# Altium schematic sheet Ultrascale_EG2.SchDoc
size B; Organization: Altium Limited; Address1: L3, 12a Rodborough Rd; Address2: Frenchs Forest; Address3: NSW; Address4: Australia 2086
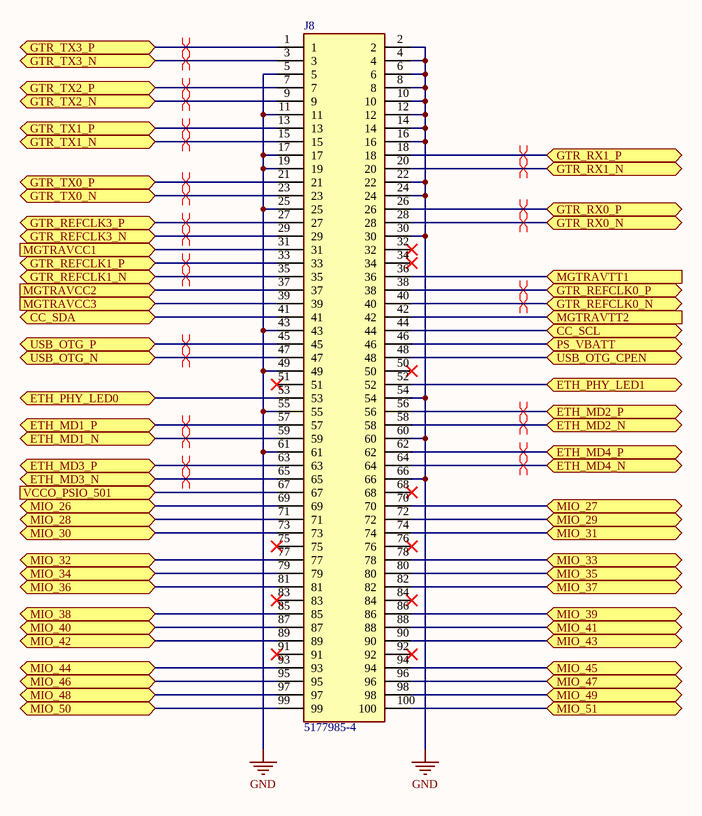
[diagram p0: Ultrascale_EG2.SchDoc]

## Parts
J8  5177985-4  [5177985-4]

## Ports
CC_SCL (bidir), CC_SDA (bidir), ETH_MD1_N (bidir), ETH_MD1_P (bidir), ETH_MD2_N (bidir), ETH_MD2_P (bidir), ETH_MD3_N (bidir), ETH_MD3_P (bidir), ETH_MD4_N (bidir), ETH_MD4_P (bidir), ETH_PHY_LED0 (bidir), ETH_PHY_LED1 (bidir), GTR_REFCLK0_N (bidir), GTR_REFCLK0_P (bidir), GTR_REFCLK1_N (bidir), GTR_REFCLK1_P (bidir), GTR_REFCLK3_N (bidir), GTR_REFCLK3_P (bidir), GTR_RX0_N (bidir), GTR_RX0_P (bidir), GTR_RX1_N (bidir), GTR_RX1_P (bidir), GTR_TX0_N (bidir), GTR_TX0_P (bidir), GTR_TX1_N (bidir), GTR_TX1_P (bidir), GTR_TX2_N (bidir), GTR_TX2_P (bidir), GTR_TX3_N (bidir), GTR_TX3_P (bidir), MGTRAVCC1 (in), MGTRAVCC2 (in), MGTRAVCC3 (in), MGTRAVTT1 (in), MGTRAVTT2 (in), MIO_26 (bidir), MIO_27 (bidir), MIO_28 (bidir), MIO_29 (bidir), MIO_30 (bidir), MIO_31 (bidir), MIO_32 (bidir), MIO_33 (bidir), MIO_34 (bidir), MIO_35 (bidir), MIO_36 (bidir), MIO_37 (bidir), MIO_38 (bidir), MIO_39 (bidir), MIO_40 (bidir), MIO_41 (bidir), MIO_42 (bidir), MIO_43 (bidir), MIO_44 (bidir), MIO_45 (bidir), MIO_46 (bidir), MIO_47 (bidir), MIO_48 (bidir), MIO_49 (bidir), MIO_50 (bidir), MIO_51 (bidir), PS_VBATT (bidir), USB_OTG_CPEN (bidir), USB_OTG_N (bidir), USB_OTG_P (bidir), VCCO_PSIO_501 (in)

## Nets
GND: J8.2 J8.4 J8.5 J8.6 J8.8 J8.10 J8.11 J8.12 J8.14 J8.16 J8.17 J8.19 J8.22 J8.24 J8.25 J8.30 J8.43 J8.49 J8.54 J8.55 J8.60 J8.61 J8.66
CC_SCL: J8.44 ; port CC_SCL
CC_SDA: J8.41 ; port CC_SDA
ETH_MD1_N: J8.59 ; port ETH_MD1_N
ETH_MD1_P: J8.57 ; port ETH_MD1_P
ETH_MD2_N: J8.58 ; port ETH_MD2_N
ETH_MD2_P: J8.56 ; port ETH_MD2_P
ETH_MD3_N: J8.65 ; port ETH_MD3_N
ETH_MD3_P: J8.63 ; port ETH_MD3_P
ETH_MD4_N: J8.64 ; port ETH_MD4_N
ETH_MD4_P: J8.62 ; port ETH_MD4_P
ETH_PHY_LED0: J8.53 ; port ETH_PHY_LED0
ETH_PHY_LED1: J8.52 ; port ETH_PHY_LED1
GTR_REFCLK0_N: J8.40 ; port GTR_REFCLK0_N
GTR_REFCLK0_P: J8.38 ; port GTR_REFCLK0_P
GTR_REFCLK1_N: J8.35 ; port GTR_REFCLK1_N
GTR_REFCLK1_P: J8.33 ; port GTR_REFCLK1_P
GTR_REFCLK3_N: J8.29 ; port GTR_REFCLK3_N
GTR_REFCLK3_P: J8.27 ; port GTR_REFCLK3_P
GTR_RX0_N: J8.28 ; port GTR_RX0_N
GTR_RX0_P: J8.26 ; port GTR_RX0_P
GTR_RX1_N: J8.20 ; port GTR_RX1_N
GTR_RX1_P: J8.18 ; port GTR_RX1_P
GTR_TX0_N: J8.23 ; port GTR_TX0_N
GTR_TX0_P: J8.21 ; port GTR_TX0_P
GTR_TX1_N: J8.15 ; port GTR_TX1_N
GTR_TX1_P: J8.13 ; port GTR_TX1_P
GTR_TX2_N: J8.9 ; port GTR_TX2_N
GTR_TX2_P: J8.7 ; port GTR_TX2_P
GTR_TX3_N: J8.3 ; port GTR_TX3_N
GTR_TX3_P: J8.1 ; port GTR_TX3_P
MGTRAVCC1: J8.31 ; port MGTRAVCC1
MGTRAVCC2: J8.37 ; port MGTRAVCC2
MGTRAVCC3: J8.39 ; port MGTRAVCC3
MGTRAVTT1: J8.36 ; port MGTRAVTT1
MGTRAVTT2: J8.42 ; port MGTRAVTT2
MIO_26: J8.69 ; port MIO_26
MIO_27: J8.70 ; port MIO_27
MIO_28: J8.71 ; port MIO_28
MIO_29: J8.72 ; port MIO_29
MIO_30: J8.73 ; port MIO_30
MIO_31: J8.74 ; port MIO_31
MIO_32: J8.77 ; port MIO_32
MIO_33: J8.78 ; port MIO_33
MIO_34: J8.79 ; port MIO_34
MIO_35: J8.80 ; port MIO_35
MIO_36: J8.81 ; port MIO_36
MIO_37: J8.82 ; port MIO_37
MIO_38: J8.85 ; port MIO_38
MIO_39: J8.86 ; port MIO_39
MIO_40: J8.87 ; port MIO_40
MIO_41: J8.88 ; port MIO_41
MIO_42: J8.89 ; port MIO_42
MIO_43: J8.90 ; port MIO_43
MIO_44: J8.93 ; port MIO_44
MIO_45: J8.94 ; port MIO_45
MIO_46: J8.95 ; port MIO_46
MIO_47: J8.96 ; port MIO_47
MIO_48: J8.97 ; port MIO_48
MIO_49: J8.98 ; port MIO_49
MIO_50: J8.99 ; port MIO_50
MIO_51: J8.100 ; port MIO_51
PS_VBATT: J8.46 ; port PS_VBATT
USB_OTG_CPEN: J8.48 ; port USB_OTG_CPEN
USB_OTG_N: J8.47 ; port USB_OTG_N
USB_OTG_P: J8.45 ; port USB_OTG_P
VCCO_PSIO_501: J8.67 ; port VCCO_PSIO_501

Not connected (* = marked no-connect by the designer): J8 32* 34* 50* 51* 68* 75* 76* 83* 84* 91* 92*

## Layout directives
differential pair: ETH_MD1_N, ETH_MD1_P, ETH_MD2_N, ETH_MD2_P, ETH_MD3_N, ETH_MD3_P, ETH_MD4_N, ETH_MD4_P, GTR_REFCLK0_N, GTR_REFCLK0_P, GTR_REFCLK1_N, GTR_REFCLK1_P, GTR_REFCLK3_N, GTR_REFCLK3_P, GTR_RX0_N, GTR_RX0_P, GTR_RX1_N, GTR_RX1_P, GTR_TX0_N, GTR_TX0_P, GTR_TX1_N, GTR_TX1_P, GTR_TX2_N, GTR_TX2_P, GTR_TX3_N, GTR_TX3_P, USB_OTG_N, USB_OTG_P

## Notes on the sheet
- Title
- Size:
- Date:
- B
- Number:
- Time:
- Revision:
- Sheet
- of
- File:

## Library data of the parts
J8 = 5177985-4: Connector; Manufacturer_Name: TE Connectivity; Allied_Number: R1112643; Datasheet Link: https://www.te.com/commerce/DocumentDelivery/DDEController?Action=srchrtrv&DocNm=5177985&DocType=Customer+Drawing&DocLang=English&DocFormat=pdf&PartCntxt=5177985-4; Manufacturer_Part_Number: 5177985-4; Mouser Part Number: 571-5177985-4; Mouser Price/Stock: https://www.mouser.com/Search/Refine.aspx?Keyword=571-5177985-4; RS Part Number: 1647793; RS Price/Stock: http://uk.rs-online.com/web/p/products/1647793; Allied Price/Stock: http://www.alliedelec.com/te-connectivity-5177985-4/R1112643/